# EAGLE design KÖF2_J3_013_01_05 (EAGLE 5.10)

## Sheet 1 of 2
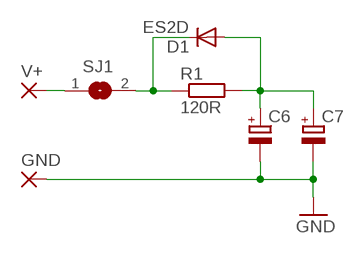
[diagram p0: schematic, sheet 1]

### Parts
C6  CPOL-EUE3-6,5  [E3-6,5]
C7  CPOL-EUE3-6,5  [E3-6,5]
D1  ES2D  [SMB]
GND  SMD-LONG1,27-1,9  [SMD1,27-1,9]
R1  120R  R-EU_R0603S  [R0603S]
SJ1  SJ"  [SJ]
V+  SMD-LONG1,27-1,9  [SMD1,27-1,9]

### Nets
GND: C6.- C7.- GND.1(P)
N$2: D1.C R1.1 SJ1.2
N$3: C6.+ C7.+ D1.A R1.2
ORANGE: SJ1.1 V+.1(P) ; also sheet 2

## Sheet 2 of 2
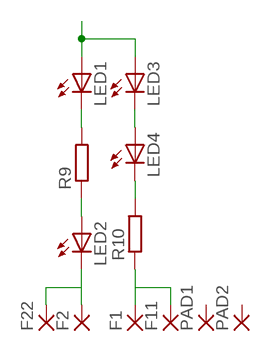
[diagram p1: schematic, sheet 2]

### Parts
F1  SMD-LONG1,27-1,9  [SMD1,27-1,9]
F2  SMD-LONG1,27-1,9  [SMD1,27-1,9]
F11  SMD-LONG1,0-1,75  [SMD1,0-1,75]
F22  SMD-LONG1,0-1,75  [SMD1,0-1,75]
LED1  LEDCHIPLED_0603-JP  [CHIPLED-0603-JP]
LED2  LEDCHIPLED_0603-JP  [CHIPLED-0603-JP]
LED3  LEDCHIPLED_0603-JP  [CHIPLED-0603-JP]
LED4  LEDCHIPLED_0603-JP  [CHIPLED-0603-JP]
PAD1  SMD-LONG1,0-1,5  [SMD1,0-1,5]
PAD2  SMD-LONG1,0-1,5  [SMD1,0-1,5]
R9  R-EU_R0603  [R0603]
R10  R-EU_R0603  [R0603]

### Nets
AUX1: F2.1(P) F22.1(P) LED2.C
AUX2: F1.1(P) F11.1(P) R10.1
N$5: LED2.A R9.1
N$6: LED1.C R9.2
N$7: LED4.C R10.2
N$8: LED3.C LED4.A
ORANGE: LED1.A LED3.A ; also sheet 1
Unconnected: PAD1.1(P) PAD2.1(P)

## Library data of the parts
C6 C7 = rcl:CPOL-EU: POLARIZED CAPACITOR, European symbol
D1 = diode:ES2D: DIODE super fast rectifier, 2 A
F1 F2 F11 F22 GND PAD1 PAD2 V+ = wirepad:SMD-LONG
LED1-LED4 = led:LED: LED OSRAM: - CHIPLED LG R971, LG N971, LY N971, LG Q971, LY Q971, LO R971, LY R971 LH N974, LH R974 LS Q976, LO Q976, LY Q976 LO Q996 - Hyper CHIPLED LW Q18S LB Q993, LB Q99A, LB R99A - SideLED LS A670, LO A670, LY A670, LG A670, LP A670 LB A673, LV A673, LT A673, LW A673 LH A674 LY A675 LS A676, LA A676, LO A676, LY A676, LW A676 LS A679, LY A679, LG A679 - Hyper Micro SIDELED® LS Y876, LA Y876, LO Y876, LY Y876 LT Y87S - SmartLED LW L88C, LW L88S LB L89C, LB L89S, LG L890 LS L89K, LO L89K, LY L89K LS L896, LA L896, LO L896, LY L896 - TOPLED LS T670, LO T670, LY T670, LG T670, LP T670 LSG T670, LSP T670, LSY T670, LOP T670, LYG T670 LG T671, LOG T671, LSG T671 LB T673, LV T673, LT T673, LW T673 LH T674 LS T676, LA T676, LO T676, LY T676, LB T676, LH T676, LSB T676, LW T676 LB T67C, LV T67C, LT T67C, LS T67K, LO T67K, LY T67K, LW E67C LS E67B, LA E67B, LO E67B, LY E67B, LB E67C, LV E67C, LT E67C LW T67C LS T679, LY T679, LG T679 LS T770, LO T770, LY T770, LG T770, LP T770 LB T773, LV T773, LT T773, LW T773 LH T774 LS E675, LA E675, LY E675, LS T675 LS T776, LA T776, LO T776, LY T776, LB T776 LHGB T686 LT T68C, LB T68C - Hyper Mini TOPLED® LB M676 - Mini TOPLED Santana® LG M470 LS M47K, LO M47K, LY M47K Source: http://www.osram.convergy.de LUXEON: - LUMILED® LXK2-PW12-R00, LXK2-PW12-S00, LXK2-PW14-U00, LXK2-PW14-V00 LXK2-PM12-R00, LXK2-PM12-S00, LXK2-PM14-U00 LXK2-PE12-Q00, LXK2-PE12-R00, LXK2-PE12-S00, LXK2-PE14-T00, LXK2-PE14-U00 LXK2-PB12-K00, LXK2-PB12-L00, LXK2-PB12-M00, LXK2-PB14-N00, LXK2-PB14-P00, LXK2-PB14-Q00 LXK2-PR12-L00, LXK2-PR12-M00, LXK2-PR14-Q00, LXK2-PR14-R00 LXK2-PD12-Q00, LXK2-PD12-R00, LXK2-PD12-S00 LXK2-PH12-R00, LXK2-PH12-S00 LXK2-PL12-P00, LXK2-PL12-Q00, LXK2-PL12-R00 Source: www.luxeon.com KINGBRIGHT: KA-3528ASYC Source: www.kingbright.com
R1 R9 R10 = rcl:R-EU_: RESISTOR, European symbol
SJ1 = jumper:SJ: SMD solder JUMPER

## Board
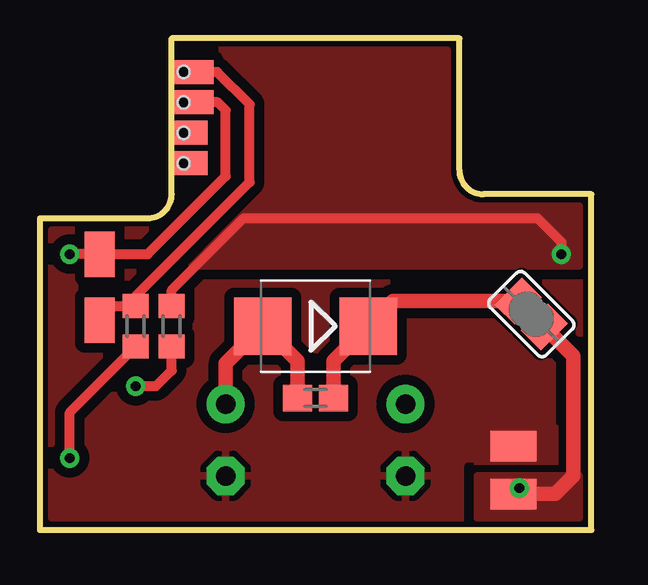
[diagram p2: board, top side]
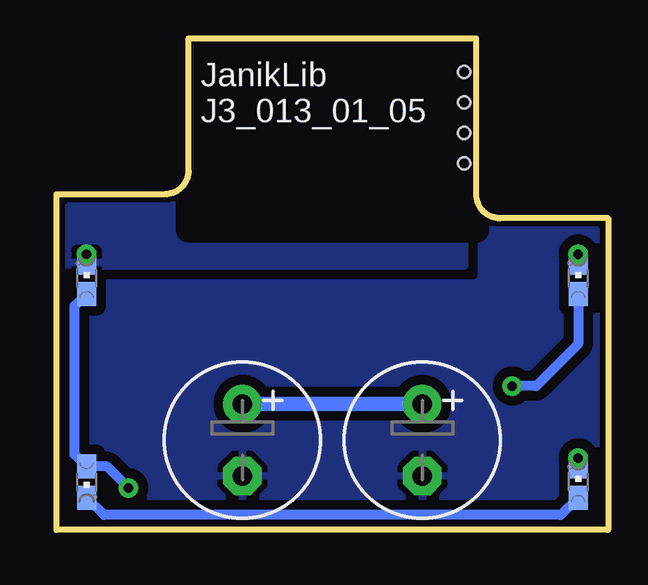
[diagram p3: board, bottom side, seen from below]

No outline drawn. Coordinates in mm, seen from the top.
Copper layers (1*16): Top 0.035mm / dielectric 1.5mm / Bottom 0.035mm
Design rules "default *": minimum track width 10mil, minimum drill 0.4mm, track to track 8mil, track to pad 8mil, pad to pad 8mil, via to via 8mil, smd to smd 8mil, copper to edge 40mil, drill to drill 8mil, minimum pad ring 10mil, minimum via ring 8mil, stop-mask expansion 4mil, vias tented up to drill 0mil, thermal gap 10mil
Holes 0.5 mm at 6,19.1 6,17.83 6,16.56 6,15.29
tKeepout: area 6.2,11.5 to 17.2,20.5
bRestrict: area 5.5,12.5 to 17.5,20.5
Milling: 10 lines

### Footprints (pad centres in the part's own frame; a part is rotated, then mirrored left to right if it is on the bottom)
E3-6,5 = drill 0.813 pad 1.6 round: + -1.5,0 | drill 0.813 pad 1.6 octagon: - 1.5,0
SMB = smd 2.4 x 2.4: A 2.2,0; C -2.2,0
SMD1,27-1,9 = smd 1.27 x 1.905: 1 0,0
SMD1,0-1,75 = smd 1 x 1.75: 1 0,0
CHIPLED-0603-JP = smd 0.8 x 1: A 0,-0.65; C 0,0.65
SMD1,0-1,5 = smd 1 x 1.5: 1 0,0
R0603S = smd 1.2 x 1.1: 1 -0.75,0; 2 0.75,0
R0603 = smd 1 x 1.1: 1 -0.85,0; 2 0.85,0
SJ = smd 1.168 x 1.6: 1 -0.762,0; 2 0.762,0

### Placement (x,y rotation side)
C6  7.75,3.75 270 bottom
C7  15.25,3.75 270 bottom
D1  11.5,8.5 180 top
F1  2.5,8.75 0 top
F2  2.5,11.5 180 top
F11  6.38,19.1 90 top
F22  6.38,17.83 90 top
GND  19.75,3.5 90 top
LED1  21.75,10.5 0 bottom
LED2  1.25,10.5 0 bottom
LED3  21.75,2 180 bottom
LED4  1.25,2 0 bottom
PAD1  6.25,16.56 90 top
PAD2  6.25,15.29 90 top
R1  11.5,5.5 180 top
R9  5.5,8.5 90 top
R10  4,8.5 270 top
SJ1  20.5,9 135 top
V+  19.75,1.5 90 top

### Tracks (layer width: path | path; a pad name or v marks a point on that pad's centre or on a via)
AUX1  (via drill 0.4)
  Top 0.406: v1.25,11.5 F2.1 4.5,11.5 7.75,14.75 7.75,17.5 7.42,17.83 F22.1
  Bottom 0.406: v1.25,11.5 LED2.C
AUX2
  Top 0.406: F11.1 7.4,19.1 8.75,17.75 8.75,14.5 4,9.75 R10.1 3.1,9.35 F1.1
GND
  pour Top (isolate 0.406, rank 2): 22.5,13.5 18.5,13.5 arc-90 17,15 17,20 6,20 6,14 arc-90 4.5,12.5 0.5,12.5 0.5,0.5 22.5,0.5
  pour Bottom (isolate 0.406, rank 2): 22.5,13.5 18.5,13.5 arc-90 17,15 17,20 6,20 6,14 arc-90 4.5,12.5 0.5,12.5 0.5,0.5 22.5,0.5
  pour Top (isolate 0.305, rank 2, no thermals): 21.5,4.25 21.5,2.75 18.25,2.75 18.25,4.5 20.25,4.5 20.5,4.25
N$2
  Top 0.61: SJ1.2 14.74,9.54 D1.C 12.25,7.05 R1.1
N$3
  Top 0.61: R1.2 10.75,7.05 D1.A 7.75,6.95 C6.+
  Bottom 0.61: C6.+ C7.+
N$5  (via drill 0.4)
  Top 0.406: v4,6 4.85,6 5.5,6.65 R9.1
  Bottom 0.406: LED2.A 1.25,7.75 3,6 v4,6
N$6  (via drill 0.4)
  Top 0.406: v21.75,11.5 21.75,12 20.75,13 8.5,13 5.5,10 R9.2
  Bottom 0.406: v21.75,11.5 LED1.C
  pour Bottom (isolate 0.406): 22.5,13.5 18.5,13.5 arc-90 17,15 17,20 6,20 6,11 22.5,11
  pour Top (isolate 0.406): 22.5,13.5 18.5,13.5 arc-90 17,15 17,20 6,20 6,11 22.5,11
N$7  (via drill 0.4)
  Top 0.406: v1.25,3 1.25,4.9 R10.2
  Bottom 0.406: LED4.C v1.25,3
N$8
  Bottom 0.406: LED4.A 1.98,0.62 21.02,0.62 LED3.C
ORANGE  (via drill 0.4)
  Top 0.61: SJ1.1 22.25,7.25 22.25,2.25 21.5,1.5 V+.1 v20,1.75
  Bottom 0.406: LED1.A 22.25,9.35 22.25,3.15 LED3.A 20.9,2.65 v20,1.75
  pour Top (isolate 0.305, no thermals): 22.5,0.5 18.25,0.5 18.25,2.25 22.5,2.25

### Text on the board
bNames: JanikLib | J3_013_01_05
tStop: BRAWA | Köf 2 | design by Janik Merz | F2 | F1 | GD | V+
bStop: C+ | GND